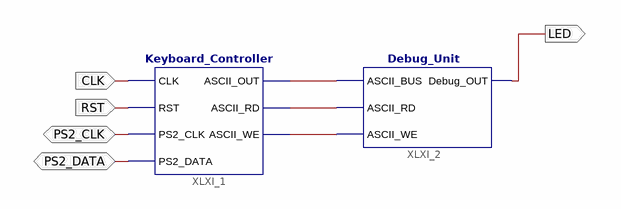
[diagram p0: schematic sheet 1]
// Xilinx ISE schematic Debug_Unit_TopLevel.sch (spartan3e) as structural Verilog: 2 symbols, 5 ports
module Debug_Unit_TopLevel (
  input  CLK,
  input  RST,
  inout  PS2_CLK,
  inout  PS2_DATA,
  output LED
);

  wire XLXN_1, XLXN_2, XLXN_4;

  Debug_Unit XLXI_2 (.ASCII_BUS(XLXN_1), .ASCII_RD(XLXN_2), .ASCII_WE(XLXN_4), .Debug_OUT(LED));
  Keyboard_Controller XLXI_1 (
    .CLK(CLK), .RST(RST), .PS2_CLK(PS2_CLK), .PS2_DATA(PS2_DATA), .ASCII_OUT(XLXN_1), .ASCII_RD(XLXN_2),
    .ASCII_WE(XLXN_4));
endmodule
